# EasyEDA Pro project ProDocument_FAB-O-MATIC_2024-05-17.epro

# Schematic FAB-O-MATIC

## Sheets
1 Schematics
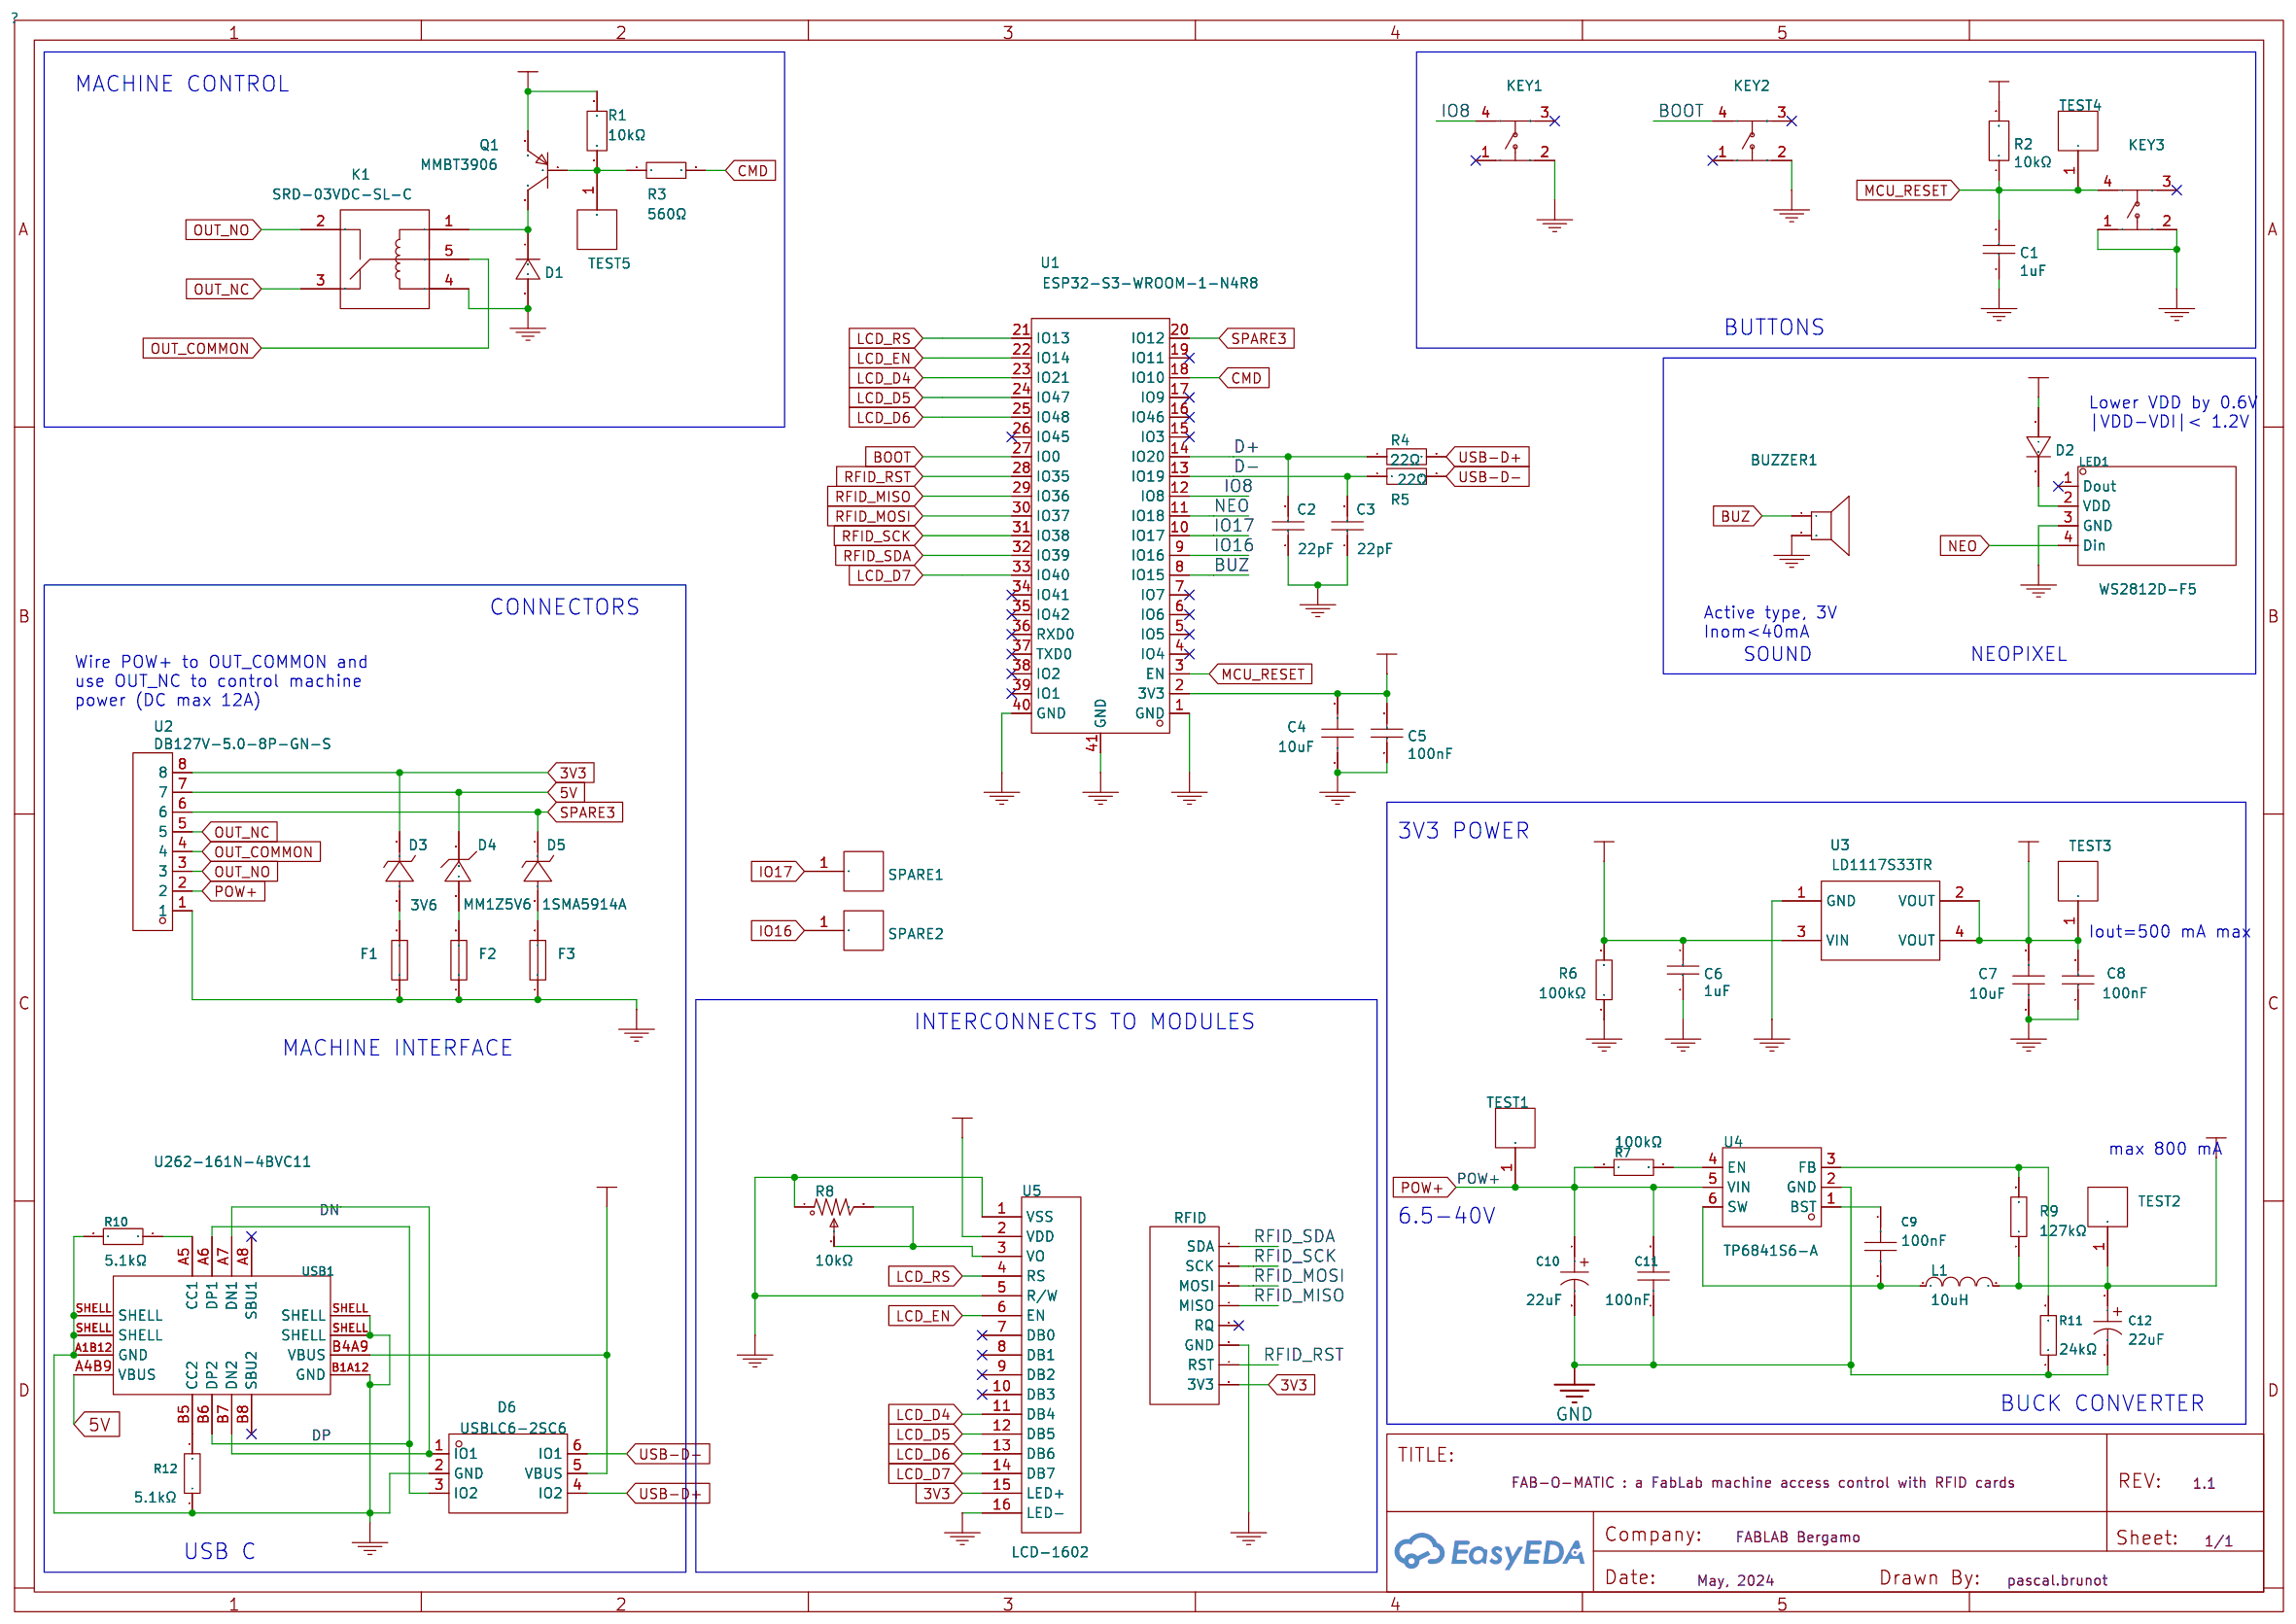
[diagram p0: Schematics]
2 Notes: Create Date: 2024-05-12; Page Name: Notes; Project Name: FAB-O-MATIC : a FabLab machine access control with RFID cards; Schematic Name: FAB-O-MATIC; Update Date: 2024-05-17; Company: EasyEDA.com; Drawn: EasyEDA; Page Size: A4; Part Number: JLCPCB-002; Reviewed: EasyEDA; Version: V0.1
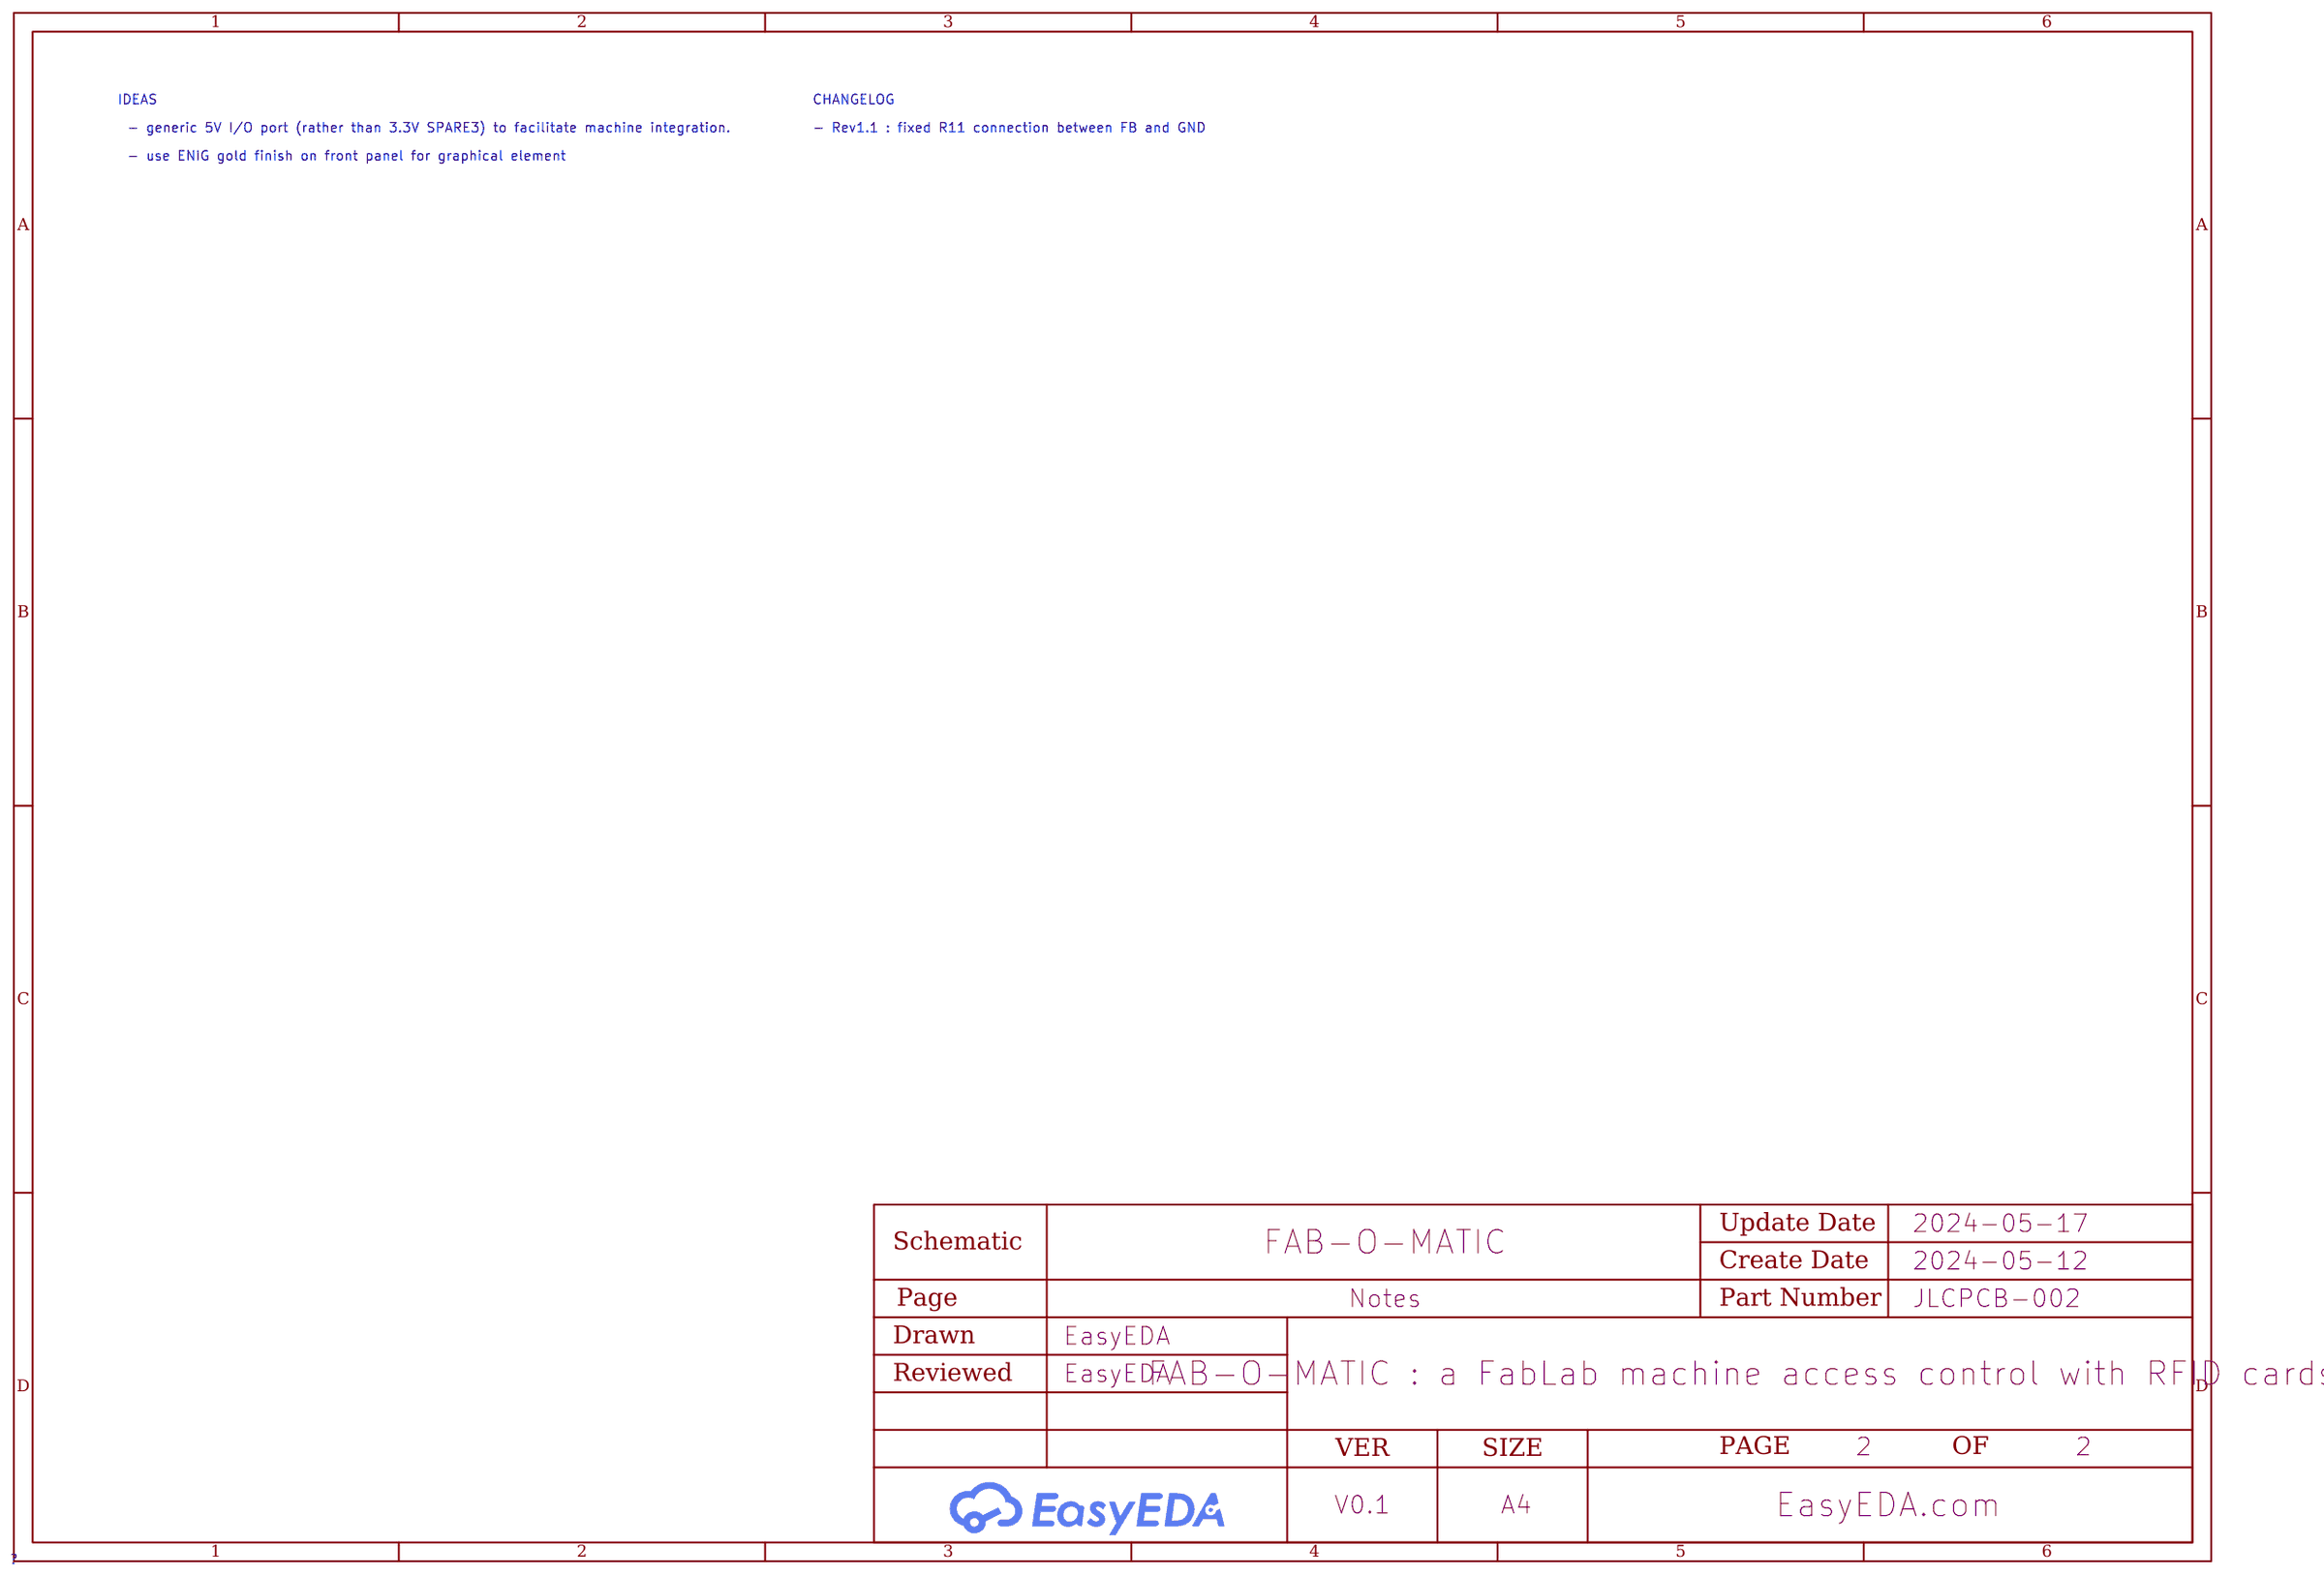
[diagram p1: Notes]

## Parts
BUZZER1  4kHz  [BUZ-TH_BD12.5-P6.50-D0.9]
C1  1uF  [C0805]
C2  22pF  [C0603]
C3  22pF  [C0603]
C4  10uF  [C0805]
C5  100nF  [C0805]
C6  1uF  [C0805]
C7  10uF  [C0805]
C8  100nF  [C0805]
C9  100nF  [C0603]
C10  22uF  [CAP-SMD_BD6.3-L6.6-W6.6-FD]
C11  100nF  [C0603]
C12  22uF  [CAP-SMD_BD6.3-L6.6-W6.6-FD]
D1  SM4007PL  [SOD-123F_L2.8-W1.8-LS3.7-RD]
D2  SM4007PL  [SOD-123F_L2.8-W1.8-LS3.7-RD]
D3  3V6  [SMA_L4.4-W2.6-LS5.1-RD]
D4  MM1Z5V6  [SOD-123_L2.8-W1.8-LS3.7-RD]
D5  1SMA5914A  [SMA_L4.4-W2.6-LS5.1-RD]
D6  USBLC6-2SC6  [SOT-23-6_L2.9-W1.6-P0.95-LS2.8-BL]
F1  1206L016WR  [F1206]
F2  1206L016WR  [F1206]
F3  1206L016WR  [F1206]
K1  SRD-03VDC-SL-C  [RELAY-TH_SRD-03VDC-SL-C]
KEY1  TSA063G60-250  [KEY-SMD_4P-L6.1-W6.1-P4.50-LS9.0]
KEY2  TSA063G60-250  [KEY-SMD_4P-L6.1-W6.1-P4.50-LS9.0]
KEY3  TSA063G60-250  [KEY-SMD_4P-L6.1-W6.1-P4.50-LS9.0]
L1  10uH  [IND-SMD_L4.0-W4.0]
LED1  WS2812D-F5  [LED-TH_4P-BD5.8-P1.30]
P1  RFID  [footprint_17af]
Q1  MMBT3906  [SOT-23-3_L2.9-W1.3-P1.90-LS2.4-BR]
R1  10kΩ  [R0805]
R2  10kΩ  [R0805]
R3  560Ω  [R0805]
R4  22Ω  [R0603]
R5  22Ω  [R0603]
R6  100kΩ  [R0805]
R7  100kΩ  [R0603]
R8  10kΩ  [RES-ADJ-TH_3362P]
R9  127kΩ  [R0603]
R10  5.1kΩ  [R0603]
R11  24kΩ  [R0603]
R12  5.1kΩ  [R0603]
SPARE1  0577-0-43-80-21-27-10-0  [footprint_662d]  (no BOM)
SPARE2  0577-0-43-80-21-27-10-0  [footprint_662d]  (no BOM)
TEST1  0577-0-43-80-21-27-10-0  [footprint_662d]  (no BOM)
TEST2  0577-0-43-80-21-27-10-0  [footprint_662d]  (no BOM)
TEST3  0577-0-43-80-21-27-10-0  [footprint_662d]  (no BOM)
TEST4  0577-0-43-80-21-27-10-0  [footprint_662d]  (no BOM)
TEST5  0577-0-43-80-21-27-10-0  [footprint_662d]  (no BOM)
U1  ESP32-S3-WROOM-1-N4R8  [WIRELM-SMD_ESP32-S3-WROOM-1]
U2  DB127V-5.0-8P-GN-S  [CONN-TH_8P-P5.00_DB127V-5.0-8P-GN-S]
U3  LD1117S33TR  [SOT-223_L6.5-W3.5-P2.30-LS7.0-BR]
U4  TP6841S6-A  [SOT-23-6_L2.9-W1.6-P0.95-LS2.8-BL]
U5  LCD-1602  [footprint_8a57]
USB1  U262-161N-4BVC11  [USB-3.1-SMD_U262-161N-4BVC11]

## Library data of the parts
BUZZER1 = SFN-12055PA6.5_C360607: Oscillator Circuit:无源(外部驱动) Technology Type:压电式 Frequency:4kHz Sound Pressure Level (SPL):80dB@5V,10cm Diameter (φD):12.5mm Height:6mm; LCSC Part Name: 压电无源蜂鸣器; Supplier Part: C360607; Manufacturer: S&S(海旭); Manufacturer Part: SFN-12055PA6.5; Supplier Footprint: 插件,D=12.5mm; JLCPCB Part Class: Extended Part; Datasheet: https://atta.szlcsc.com/upload/public/pdf/source/20220225/D801AF3A55A67CFB490E002F7E7725D1.pdf; Supplier: LCSC; Oscillator Circuit: 无源(外部驱动); Technology Type: 压电式; Sound Pressure Level (SPL): 80dB@5V,10cm; Diameter (φD): 12.5mm; Height: 6mm
C1 C6 = CL21B105KBFNNNE: Capacitance: Tolerance:±10% Tolerance:±10% Voltage Rated: Temperature Coefficient:; LCSC Part Name: 1uF ±10% 50V; Supplier Part: C28323; Manufacturer: SAMSUNG(三星); Supplier Footprint: 0805; JLCPCB Part Class: Basic Part; Datasheet: https://atta.szlcsc.com/upload/public/pdf/source/20160218/1457707763339.pdf; Supplier: LCSC; Tolerance: ±10%
C2 C3 = CL10C220JB8NNNC: Capacitance: Tolerance:±5% Tolerance:±5% Voltage Rated: Temperature Coefficient:; LCSC Part Name: 22pF ±5% 50V; Supplier Part: C1653; Manufacturer: SAMSUNG(三星); Supplier Footprint: 0603; JLCPCB Part Class: Basic Part; Datasheet: https://atta.szlcsc.com/upload/public/pdf/source/20160218/1457707763339.pdf; Supplier: LCSC; Tolerance: ±5%
C4 C7 = GRM21BR61H106KE43L: Capacitance: Tolerance:±10% Tolerance:±10% Voltage Rated: Temperature Coefficient:; LCSC Part Name: 10uF ±10% 50V; Supplier Part: C440198; Manufacturer: muRata(村田); Supplier Footprint: 0805; JLCPCB Part Class: Basic Part; Datasheet: https://atta.szlcsc.com/upload/public/pdf/source/20230811/95AAE0C9AF55EDC31B7A4D8B733F534E.pdf; Supplier: LCSC; Tolerance: ±10%
C5 C8 = CL21B104KCFNNNE: Capacitance: Tolerance:±10% Tolerance:±10% Voltage Rated: Temperature Coefficient:; LCSC Part Name: 100nF ±10% 100V; Supplier Part: C28233; Manufacturer: SAMSUNG(三星); Supplier Footprint: 0805; JLCPCB Part Class: Basic Part; Datasheet: https://atta.szlcsc.com/upload/public/pdf/source/20160218/1457707763339.pdf; Supplier: LCSC; Tolerance: ±10%
C9 C11 = CC0603KRX7R9BB104: Capacitance: Tolerance:±10% Tolerance:±10% Voltage Rated: Temperature Coefficient:; LCSC Part Name: 100nF ±10% 50V; Supplier Part: C14663; Manufacturer: YAGEO(国巨); Supplier Footprint: 0603; JLCPCB Part Class: Basic Part; Datasheet: https://atta.szlcsc.com/upload/public/pdf/source/20180910/C282072_33301C7F631E79921B82A8DAC6BCC5B3.pdf; Supplier: LCSC; Tolerance: ±10%
C10 C12 = RVT22UF50V67RV0028: Capacitance: Tolerance:±20% Tolerance:±20% Rated Voltage: Ripple Current:43mA@120Hz Equivalent Series Resistance(ESR):- φD: L: Lifetime @ Temp:2000hrs@105℃ Operating Temperature:-55℃~+105℃ Operating Temperature:-55℃~+105℃; LCSC Part Name: 22uF ±20% 50V; Supplier Part: C2836438; Manufacturer: KNSCHA(科尼盛); Supplier Footprint: SMD,D6.3xL5.4mm; JLCPCB Part Class: Extended Part; Datasheet: https://atta.szlcsc.com/upload/public/pdf/source/20210528/C2836438_BFA13B3627CC6B20ADD0B3BB98082A71.pdf; Supplier: LCSC; Tolerance: ±20%; Ripple Current: 43mA@120Hz; Lifetime @ Temp: 2000hrs@105℃; Operating Temperature: -55℃~+105℃
D1 D2 = SM4007PL_C64898: Diode Configuration: Forward Voltage (Vf@If):1.1V@1A Reverse Voltage (Vr): Average Rectified Current (Io): Reverse Leakage Current:10uA@1kV; LCSC Part Name: 电压:1kV 电流:1A; Supplier Part: C64898; Manufacturer: MDD; Supplier Footprint: SOD-123FL; JLCPCB Part Class: Basic Part; Datasheet: https://atta.szlcsc.com/upload/public/pdf/source/20230823/16A8FDE162764C9B685A3717F2DA3690.pdf; Supplier: LCSC; Forward Voltage (Vf@If): 1.1V@1A; Reverse Leakage Current: 10uA@1kV
D3 D5 = 1SMA5914A: Zener Voltage (Nom):3.6V Reverse Leakage Current (Ir):75uA@1V Power Dissipation:1.5W Tolerance:±5% Tolerance:±5%; Supplier Part: C713621; Manufacturer: LGE(鲁光); Supplier Footprint: DO-214AC(SMA); JLCPCB Part Class: Extended Part; Datasheet: https://atta.szlcsc.com/upload/public/pdf/source/20200826/C688904_8C7260726BAA69A6ECCD821EC44D7B0B.pdf; Supplier: LCSC; Zener Voltage (Nom): 3.6V; Reverse Leakage Current (Ir): 75uA@1V; Power Dissipation: 1.5W; Tolerance: ±5%
D4 = MM1Z5V6_C85210: Diode Configuration:Single Zener Voltage (Nom):5.6V Reverse Leakage Current (Ir):1uA@2.5V Zener Voltage (Range):5.2V~6V Zener Voltage (Range):5.2V~6V Power Dissipation:500mW Zener Impedance (Zzt):80Ω Tolerance:±5% Tolerance:±5%; Supplier Part: C85210; Manufacturer: ST(先科); Supplier Footprint: SOD-123; JLCPCB Part Class: Extended Part; Datasheet: https://atta.szlcsc.com/upload/public/pdf/source/20170914/C118610_1505373983764968880.pdf; Supplier: LCSC; Diode Configuration: Single; Zener Voltage (Nom): 5.6V; Reverse Leakage Current (Ir): 1uA@2.5V; Zener Voltage (Range): 5.2V~6V; Power Dissipation: 500mW; Zener Impedance (Zzt): 80Ω; Tolerance: ±5%
D6 = USBLC6-2SC6_C2827654: polarity:- Reverse Stand-Off Voltage (Vrwm):- Maximum Clamping Voltage:- Peak Pulse Current (Ipp)@10/1000us:- Peak Pulse Power Dissipation (Ppp)@10/1000us:- Breakdown Voltage:- Reverse Leakage Current (Ir):- Operating Temperature:- Operating Temperature:-; LCSC Part Name: ESD，可防30kV静电; Supplier Part: C2827654; Manufacturer: TECH PUBLIC(台舟); Supplier Footprint: SOT-23-6; JLCPCB Part Class: Extended Part; Datasheet: https://atta.szlcsc.com/upload/public/pdf/source/20210810/FBD75DE717D6D97BAC6DD7F2B5C09DCD.pdf; Supplier: LCSC; Type: ESD
F1-F3 = 1206L016WR: Operating Voltage (Max):30V Current Rating (Max):100A Hold Current:160mA Trip Current:370mA Power Dissipation:- Resistance - Initial (Ri) (Min):1.2Ω Resistance - Post Trip (R1) (Max):4.5Ω Maximum Time to Trip:300ms Operating Temperature:-40℃~+85℃ Operatin; LCSC Part Name: 30V 160mA 1206自恢复; Supplier Part: C151161; Manufacturer: Littelfuse(美国力特); Supplier Footprint: 1206; JLCPCB Part Class: Extended Part; Datasheet: https://atta.szlcsc.com/upload/public/pdf/source/20181031/C315893_583812352E070A3E75892B744443DEDE.pdf; Supplier: LCSC; Operating Voltage (Max): 30V; Current Rating (Max): 100A; Hold Current: 160mA; Trip Current: 370mA; Resistance - Initial (Ri) (Min): 1.2Ω; Resistance - Post Trip (R1) (Max): 4.5Ω; Maximum Time to Trip: 300ms; Operating Temperature: -40℃~+85℃
K1 = SRD-03VDC-SL-C: Coil Voltage:3V Contact Form:一组转换:1C(SPDT-转换) Pin Number:5 Contact Rating:- Maximum Switching Voltage:250V@AC Coil Rated Power:360mW Maximum Switching Current:15A Coil Type:无极性-单线圈 Contact Resistance:100mΩ Operate Time:10ms Release Time:10ms; LCSC Part Name: 3V继电器 单刀双掷 蓝色; Supplier Part: C496430; Manufacturer: 松乐; Supplier Footprint: 插件,15.6x19.2mm; JLCPCB Part Class: Extended Part; Datasheet: https://atta.szlcsc.com/upload/public/pdf/source/20211029/0AF1F09028F3938DCCE87F54F358E4BA.pdf; Supplier: LCSC; Coil Voltage: 3V; Contact Form: 一组转换:1C(SPDT-转换); Pin Number: 5; Maximum Switching Voltage: 250V@AC; Coil Rated Power: 360mW; Maximum Switching Current: 15A; Coil Type: 无极性-单线圈; Contact Resistance: 100mΩ; Operate Time: 10ms; Release Time: 10ms
KEY1-KEY3 = TSA063G60-250: Circuit:SPST Actuator Style:Round Button Operating Force:250gf Mounting Style:Brick nogging Switch Length:6.1mm Switch Width:6.1mm Switch Height:6mm Strike Gundam:不带 Contact Current:50mA Voltage Rating (DC):12V Insulation Resistance:100MΩ Actuator/Cap Col; LCSC Part Name: 6.1*6.1*6mm 立贴 轻触开关; Supplier Part: C294566; Manufacturer: BRIGHT(博瑞泰); Supplier Footprint: SMD; JLCPCB Part Class: Extended Part; Datasheet: https://atta.szlcsc.com/upload/public/pdf/source/20181029/C294570_15EFF1F4D215547575AD6307D8A439BB.pdf; Supplier: LCSC; Circuit: SPST; Actuator Style: Round Button; Operating Force: 250gf; Mounting Style: Brick nogging; Switch Length: 6.1mm; Switch Width: 6.1mm; Switch Height: 6mm; Strike Gundam: 不带; Contact Current: 50mA; Voltage Rating (DC): 12V; Insulation Resistance: 100MΩ; Actuator/Cap Color: Black; With Lamp: No; Pin Style: Gull Wing; Mechanical Life: 5万次; Operating Temperature: -25℃~+70℃
L1 = SWPA4030S100MT: Inductance: Tolerance:±20% Tolerance:±20% Rated Current: Saturation Current (Isat):2.4A DC Resistance (DCR): Type:- Ratings:-; LCSC Part Name: 10uH ±20% 2.4A; Supplier Part: C38117; Manufacturer: Sunlord(顺络); Supplier Footprint: SMD; JLCPCB Part Class: Extended Part; Datasheet: https://atta.szlcsc.com/upload/public/pdf/source/20231024/317626D2AA2F8AB4113C1875E432E6E1.pdf; Supplier: LCSC; Tolerance: ±20%; Saturation Current (Isat): 2.4A
LED1 = WS2812D-F5: Lamp Holder Type:5mm圆形灯头; Supplier Part: C190565; Manufacturer: worldsemi; Supplier Footprint: 插件,D=5mm; JLCPCB Part Class: Extended Part; Datasheet: https://atta.szlcsc.com/upload/public/pdf/source/20220418/4832EF9FB0C1B68C1F4176435955B165.pdf; Supplier: LCSC; Lamp Holder Type: 5mm圆形灯头
P1 = RFID: Supplier Part: C27438; Supplier: LCSC; Manufacturer: BOOMELE; Manufacturer Part: Female headerHDR1X8-2.54
Q1 = MMBT3906_C466523: Transistor Type: Collector Current (Ic): Collector-Emitter Breakdown Voltage (Vceo): Power Dissipation (Pd): Transition Frequency (fT):300MHz Collector Cut-Off Current (Icbo):100nA Collector-Emitter Saturation Voltage (VCE(sat)@Ic,Ib):300mV@50mA,5mA Opera; LCSC Part Name: PNP 电流:200mA 耐压:40V; Supplier Part: C466523; Manufacturer: High Diode(海德); Supplier Footprint: SOT-23; JLCPCB Part Class: Extended Part; Datasheet: https://atta.szlcsc.com/upload/public/pdf/source/20191203/C466523_970B32749544E07B58B65C8C9237BEC1.pdf; Supplier: LCSC; Transition Frequency (fT): 300MHz; Collector Cut-Off Current (Icbo): 100nA; Collector-Emitter Saturation Voltage (VCE(sat)@Ic,Ib): 300mV@50mA,5mA
R1 R2 = 0805W8F1002T5E: Type:Thick Film Resistors Resistance:10kΩ Tolerance:±1% Tolerance:±1% Power(Watts): Overload Voltage (Max): Temperature Coefficient:±100ppm/℃ Temperature Coefficient:±100ppm/℃ Operating Temperature Range:-55℃~+155℃ Operating Temperature Range:-55℃~+155℃; LCSC Part Name: 10kΩ ±1% 125mW 厚膜电阻; Supplier Part: C17414; Manufacturer: UNI-ROYAL(厚声); Supplier Footprint: 0805; JLCPCB Part Class: Basic Part; Datasheet: https://atta.szlcsc.com/upload/public/pdf/source/20200306/C422600_1E6D84923E4A46A82E41ADD87F860B5C.pdf; Supplier: LCSC; Type: Thick Film Resistors; Tolerance: ±1%; Temperature Coefficient: ±100ppm/℃; Operating Temperature Range: -55℃~+155℃
R3 = 0805W8F5600T5E: Type:Thick Film Resistors Resistance: Tolerance:±1% Tolerance:±1% Power(Watts): Overload Voltage (Max): Temperature Coefficient:±100ppm/℃ Temperature Coefficient:±100ppm/℃ Operating Temperature Range:-55℃~+155℃ Operating Temperature Range:-55℃~+155℃; LCSC Part Name: 560Ω ±1% 125mW 厚膜电阻; Supplier Part: C28636; Manufacturer: UNI-ROYAL(厚声); Supplier Footprint: 0805; JLCPCB Part Class: Basic Part; Datasheet: https://atta.szlcsc.com/upload/public/pdf/source/20200306/C422600_1E6D84923E4A46A82E41ADD87F860B5C.pdf; Supplier: LCSC; Type: Thick Film Resistors; Tolerance: ±1%; Temperature Coefficient: ±100ppm/℃; Operating Temperature Range: -55℃~+155℃
R4 R5 = 0603WAF220JT5E: Type:Thick Film Resistors Resistance:22Ω Tolerance:±1% Tolerance:±1% Power(Watts): Overload Voltage (Max): Temperature Coefficient:±100ppm/℃ Temperature Coefficient:±100ppm/℃ Operating Temperature Range:-55℃~+155℃ Operating Temperature Range:-55℃~+155℃; LCSC Part Name: 22Ω ±1% 100mW 厚膜电阻; Supplier Part: C23345; Manufacturer: UNI-ROYAL(厚声); Supplier Footprint: 0603; JLCPCB Part Class: Basic Part; Datasheet: https://atta.szlcsc.com/upload/public/pdf/source/20200306/C422600_1E6D84923E4A46A82E41ADD87F860B5C.pdf; Supplier: LCSC; Type: Thick Film Resistors; Tolerance: ±1%; Temperature Coefficient: ±100ppm/℃; Operating Temperature Range: -55℃~+155℃; Resistance: 22
R6 = 0805W8F1003T5E: Type:Thick Film Resistors Resistance:100kΩ Tolerance:±1% Tolerance:±1% Power(Watts): Overload Voltage (Max): Temperature Coefficient:±100ppm/℃ Temperature Coefficient:±100ppm/℃ Operating Temperature Range:-55℃~+155℃ Operating Temperature Range:-55℃~+155℃; LCSC Part Name: 100kΩ ±1% 125mW 厚膜电阻; Supplier Part: C149504; Manufacturer: UNI-ROYAL(厚声); Supplier Footprint: 0805; JLCPCB Part Class: Basic Part; Datasheet: https://atta.szlcsc.com/upload/public/pdf/source/20200306/C422600_1E6D84923E4A46A82E41ADD87F860B5C.pdf; Supplier: LCSC; Type: Thick Film Resistors; Tolerance: ±1%; Temperature Coefficient: ±100ppm/℃; Operating Temperature Range: -55℃~+155℃
R7 = 0603WAF1003T5E: Type:Thick Film Resistors Resistance:100kΩ Tolerance:±1% Tolerance:±1% Power(Watts): Overload Voltage (Max): Temperature Coefficient:±100ppm/℃ Temperature Coefficient:±100ppm/℃ Operating Temperature Range:-55℃~+155℃ Operating Temperature Range:-55℃~+155℃; LCSC Part Name: 100kΩ ±1% 100mW 厚膜电阻; Supplier Part: C25803; Manufacturer: UNI-ROYAL(厚声); Supplier Footprint: 0603; JLCPCB Part Class: Basic Part; Datasheet: https://atta.szlcsc.com/upload/public/pdf/source/20200306/C422600_1E6D84923E4A46A82E41ADD87F860B5C.pdf; Supplier: LCSC; Type: Thick Film Resistors; Tolerance: ±1%; Temperature Coefficient: ±100ppm/℃; Operating Temperature Range: -55℃~+155℃
R8 = 3362P-1-103_C118956: Resistance: Tolerance:±10% Tolerance:±10%; LCSC Part Name: 10kΩ ±10%; Supplier Part: C118956; Manufacturer: BOCHEN(博晨); Manufacturer Part: 3362P-1-103; Supplier Footprint: 插件; JLCPCB Part Class: Extended Part; Datasheet: https://atta.szlcsc.com/upload/public/pdf/source/20171114/C118956_15106326650691117445.pdf; Supplier: LCSC; Tolerance: ±10%
R9 = RC0603FR-07127KL: Type:Thick Film Resistors Resistance: Tolerance:±1% Tolerance:±1% Power(Watts): Overload Voltage (Max): Temperature Coefficient:±100ppm/℃ Temperature Coefficient:±100ppm/℃ Operating Temperature Range:-55℃~+155℃ Operating Temperature Range:-55℃~+155℃; LCSC Part Name: 厚膜电阻 127kΩ ±1% 100mW; Supplier Part: C245905; Manufacturer: YAGEO(国巨); Supplier Footprint: 0603; JLCPCB Part Class: Extended Part; Datasheet: https://atta.szlcsc.com/upload/public/pdf/source/20181031/C326976_E9901E35333D136A19B6CE377E889A82.pdf; Supplier: LCSC; Type: Thick Film Resistors; Tolerance: ±1%; Temperature Coefficient: ±100ppm/℃; Operating Temperature Range: -55℃~+155℃
R10 R12 = 0603WAF5101T5E: Type:Thick Film Resistors Resistance:5.1kΩ Tolerance:±1% Tolerance:±1% Power(Watts): Overload Voltage (Max): Temperature Coefficient:±100ppm/℃ Temperature Coefficient:±100ppm/℃ Operating Temperature Range:-55℃~+155℃ Operating Temperature Range:-55℃~+155℃; LCSC Part Name: 5.1kΩ ±1% 100mW 厚膜电阻; Supplier Part: C23186; Manufacturer: UNI-ROYAL(厚声); Supplier Footprint: 0603; JLCPCB Part Class: Basic Part; Datasheet: https://atta.szlcsc.com/upload/public/pdf/source/20200306/C422600_1E6D84923E4A46A82E41ADD87F860B5C.pdf; Supplier: LCSC; Type: Thick Film Resistors; Tolerance: ±1%; Temperature Coefficient: ±100ppm/℃; Operating Temperature Range: -55℃~+155℃
R11 = 0603WAF2402T5E: Type:Thick Film Resistors Resistance:24kΩ Tolerance:±1% Tolerance:±1% Power(Watts): Overload Voltage (Max): Temperature Coefficient:±100ppm/℃ Temperature Coefficient:±100ppm/℃ Operating Temperature Range:-55℃~+155℃ Operating Temperature Range:-55℃~+155℃; LCSC Part Name: 24kΩ ±1% 100mW 厚膜电阻; Supplier Part: C23352; Manufacturer: UNI-ROYAL(厚声); Supplier Footprint: 0603; JLCPCB Part Class: Basic Part; Datasheet: https://atta.szlcsc.com/upload/public/pdf/source/20200306/C422600_1E6D84923E4A46A82E41ADD87F860B5C.pdf; Supplier: LCSC; Type: Thick Film Resistors; Tolerance: ±1%; Temperature Coefficient: ±100ppm/℃; Operating Temperature Range: -55℃~+155℃
SPARE1 SPARE2 TEST1-TEST5 = 0577-0-43-80-21-27-10-0: Supplier: LCSC; Supplier Part: C2895400; Manufacturer: null; JLCPCB Part Class: Extended Part
U1 = ESP32-S3-WROOM-1-N4R8: LCSC Part Name: 通用型Wi-Fi+低功耗蓝牙MCU模组; Supplier Part: C2913200; Manufacturer: ESPRESSIF(乐鑫); Supplier Footprint: SMD,18x25.5mm; JLCPCB Part Class: Extended Part; Datasheet: https://atta.szlcsc.com/upload/public/pdf/source/20220628/A2AC12B3C87735CAEB7EBE2DBE80936C.pdf; Supplier: LCSC; spicePre: U
U2 = DB127V-5.0-8P-GN-S: Structure:1x8P Pitch:5mm Color:Green Mounting Style:Straight Current Rating (Max):15A Voltage Rating (Max):250V Number of Pins:8P Number of Rows:1 Wire Gauge - AWG:14~26 Wire Gauge - AWG:14~26 Wire Gauge - mm2:1.5 Wire Gauge - mm2:1.5 Number of PINs Per R; LCSC Part Name: 5mm 1x8P 排数:1 每排P数:8 直插; Supplier Part: C430626; Manufacturer: DORABO(地博电气); Supplier Footprint: 插件,P=5mm; JLCPCB Part Class: Extended Part; Datasheet: https://atta.szlcsc.com/upload/public/pdf/source/20230106/9CDB472D403F670588C42D375AEF1B30.pdf; Supplier: LCSC; Structure: 1x8P; Pitch: 5mm; Color: Green; Mounting Style: Straight; Current Rating (Max): 15A; Voltage Rating (Max): 250V; Number of Pins: 8P; Number of Rows: 1; Wire Gauge - AWG: 14~26; Wire Gauge - mm2: 1.5; Number of PINs Per Row: 8; Operating Temperature Range: -40℃~+105℃
U3 = LD1117S33TR: Output Type: Maximum Input Voltage:15V Output Voltage:3.3V Output Voltage:3.3V MAX Output Current:800mA Power Supply Rejection Ratio (PSRR):75dB@(120Hz) Dropout Voltage:1.2V@(800mA) standby current:10mA Operating Temperature:0℃~+125℃ Operating Temperature; LCSC Part Name: 输入15V 输出3.3V 800mA; Supplier Part: C86781; Manufacturer: ST(意法半导体); Supplier Footprint: SOT-223; JLCPCB Part Class: Extended Part; Datasheet: https://atta.szlcsc.com/upload/public/pdf/source/20181022/C283467_00098992BB1D287195B66486CE33A2DD.pdf; Supplier: LCSC; Maximum Input Voltage: 15V; Output Voltage: 3.3V; MAX Output Current: 800mA; Power Supply Rejection Ratio (PSRR): 75dB@(120Hz); Dropout Voltage: 1.2V@(800mA); standby current: 10mA; Operating Temperature: 0℃~+125℃; Output Polarity: Positive electrode; Number of Outputs: 1
U4 = TP6841S6-A: Supplier Part: C2844924; Manufacturer: TECH PUBLIC(台舟); Supplier Footprint: SOT-23-6; JLCPCB Part Class: Extended Part; Datasheet: https://atta.szlcsc.com/upload/public/pdf/source/20210709/C2844924_E200F0B809810750A1B5AEDD4B4FD840.pdf; Supplier: LCSC
U5 = LCD-1602: Manufacturer Part: ?
USB1 = U262-161N-4BVC11: Connector Type:Type-C Standard:USB 3.1 Gender:Female Number of Ports:1 Number of Contacts:16P Mounting Style:卧贴 Current Rating - Power (Max):3A Contact Material:Copper Alloy Contact Plating:Gold Operating Temperature Range:-40℃~+85℃ Operating Temperature; LCSC Part Name: Type-C 母 卧贴; Supplier Part: C319148; Manufacturer: XKB Connectivity(中国星坤); Supplier Footprint: SMD; JLCPCB Part Class: Extended Part; Datasheet: https://atta.szlcsc.com/upload/public/pdf/source/20211015/B478CBA0F1623DA36A6CC6918C49C838.pdf; Supplier: LCSC; Connector Type: Type-C; Standard: USB 3.1; Gender: Female; Number of Ports: 1; Number of Contacts: 16P; Mounting Style: 卧贴; Current Rating - Power (Max): 3A; Contact Material: Copper Alloy; Contact Plating: Gold; Operating Temperature Range: -40℃~+85℃; Soldering Temperature(Max): 260℃

## Nets
3V3: C4.2 C5.2 C7.2 C8.2 D3.1(C) P1.8(3V3) Q1.1 R1.2 R2.2 TEST3.1 U1.2(3V3) U2.8 U3.2(VOUT) U3.4(VOUT) U5.15(LED+)
5V: C6.1 C12.1 D2.2(A) D4.1(C) D6.5(VBUS) L1.2 R6.2 R9.1 TEST2.1 U2.7 U3.3(VIN) U5.2(VDD) USB1.A4B9(VBUS) USB1.B4A9(VBUS)
GND: BUZZER1.2 C1.1 C2.1 C3.1 C4.1 C5.1 C6.2 C7.1 C8.1 C10.2 C11.1 C12.2 D1.2(A) D6.2(GND) F1.1 F2.1 F3.1 K1.4 KEY1.2 KEY2.2 KEY3.1 KEY3.2 LED1.3(GND) P1.6(GND) R6.1 R8.1 R10.2 R11.1 R12.1 U1.1(GND) U1.40(GND) U1.41(GND) U2.1 U3.1(GND) U4.2(GND) U5.1(VSS) U5.5(R/W) U5.16(LED-) USB1.A1B12(GND) USB1.B1A12(GND) USB1.SHELL
BOOT: KEY2.4 U1.27(IO0)
BUZ: BUZZER1.1 U1.8(IO15)
CMD: R3.2 U1.18(IO10)
D+: C2.2 R4.1 U1.14(IO20)
D-: C3.2 R5.1 U1.13(IO19)
DN: D6.1(IO1) USB1.A7(DN1) USB1.B7(DN2)
DP: D6.3(IO2) USB1.A6(DP1) USB1.B6(DP2)
IO8: KEY1.4 U1.12(IO8)
IO16: SPARE2.1 U1.9(IO16)
IO17: SPARE1.1 U1.10(IO17)
LCD_D4: U1.23(IO21) U5.11(DB4)
LCD_D5: U1.24(IO47) U5.12(DB5)
LCD_D6: U1.25(IO48) U5.13(DB6)
LCD_D7: U1.33(IO40) U5.14(DB7)
LCD_EN: U1.22(IO14) U5.6(EN)
LCD_RS: U1.21(IO13) U5.4(RS)
MCU_RESET: C1.2 KEY3.4 R2.1 TEST4.1 U1.3(EN)
NEO: LED1.4(Din) U1.11(IO18)
OUT_COMMON: K1.5 U2.4
OUT_NC: K1.3 U2.5
OUT_NO: K1.2 U2.3
POW+: C10.1 C11.2 R7.1 TEST1.1 U2.2 U4.5(VIN)
RFID_MISO: P1.4(MISO) U1.29(IO36)
RFID_MOSI: P1.3(MOSI) U1.30(IO37)
RFID_RST: P1.7(RST) U1.28(IO35)
RFID_SCK: P1.2(SCK) U1.31(IO38)
RFID_SDA: P1.1(SDA) U1.32(IO39)
SPARE3: D5.1(C) U1.20(IO12) U2.6
USB-D+: D6.4(IO2) R4.2
USB-D-: D6.6(IO1) R5.2
$1N85: D1.1(C) K1.1 Q1.3
$1N86: Q1.2 R1.1 R3.1 TEST5.1
$1N90: D2.1(C) LED1.2(VDD)
$1N92: D5.2(A) F3.2
$1N93: D3.2(A) F1.2
$1N95: D4.2(A) F2.2
$1N15737: C9.1 U4.1(BST)
$1N15956: R7.2 U4.4(EN)
$1N24952: R12.2 USB1.B5(CC2)
$1N25390: R10.1 USB1.A5(CC1)
$1N26975: R8.2 R8.3 U5.3(VO)
$1N28552: C9.2 L1.1 U4.6(SW)
Net-(R9-2): R9.2 R11.2 U4.3(FB)

Not connected (* = marked no-connect by the designer): KEY1 1* 3*; KEY2 1* 3*; KEY3 3*; LED1 1(Dout)*; P1 5(RQ)*; U1 4(IO4)* 5(IO5)* 6(IO6)* 7(IO7)* 15(IO3)* 16(IO46)* 17(IO9)* 19(IO11)* 26(IO45)* 34(IO41)* 35(IO42)* 36(RXD0)* 37(TXD0)* 38(IO2)* 39(IO1)*; U5 7(DB0)* 8(DB1)* 9(DB2)* 10(DB3)*; USB1 A8(SBU1)* B8(SBU2)*

## Notes on the sheets
sheet 1
- MACHINE CONTROL
- BUTTONS
- Lower VDD by 0.6V
  |VDD-VDI|< 1.2V
- Active type, 3V
  Inom<40mA
- CONNECTORS
- Wire POW+ to OUT_COMMON and
  use OUT_NC to control machine
  power (DC max 12A)
- SOUND
- NEOPIXEL
- 3V3 POWER
- Iout=500 mA max
- INTERCONNECTS TO MODULES
- MACHINE INTERFACE
- max 800 mA
- 6.5-40V
- BUCK CONVERTER
- USB C
sheet 2
- IDEAS
- CHANGELOG
- - generic 5V I/O port (rather than 3.3V SPARE3) to facilitate machine integration.
- - Rev1.1 : fixed R11 connection between FB and GND
- - use ENIG gold finish on front panel for graphical element

# Board PCB REV1.1
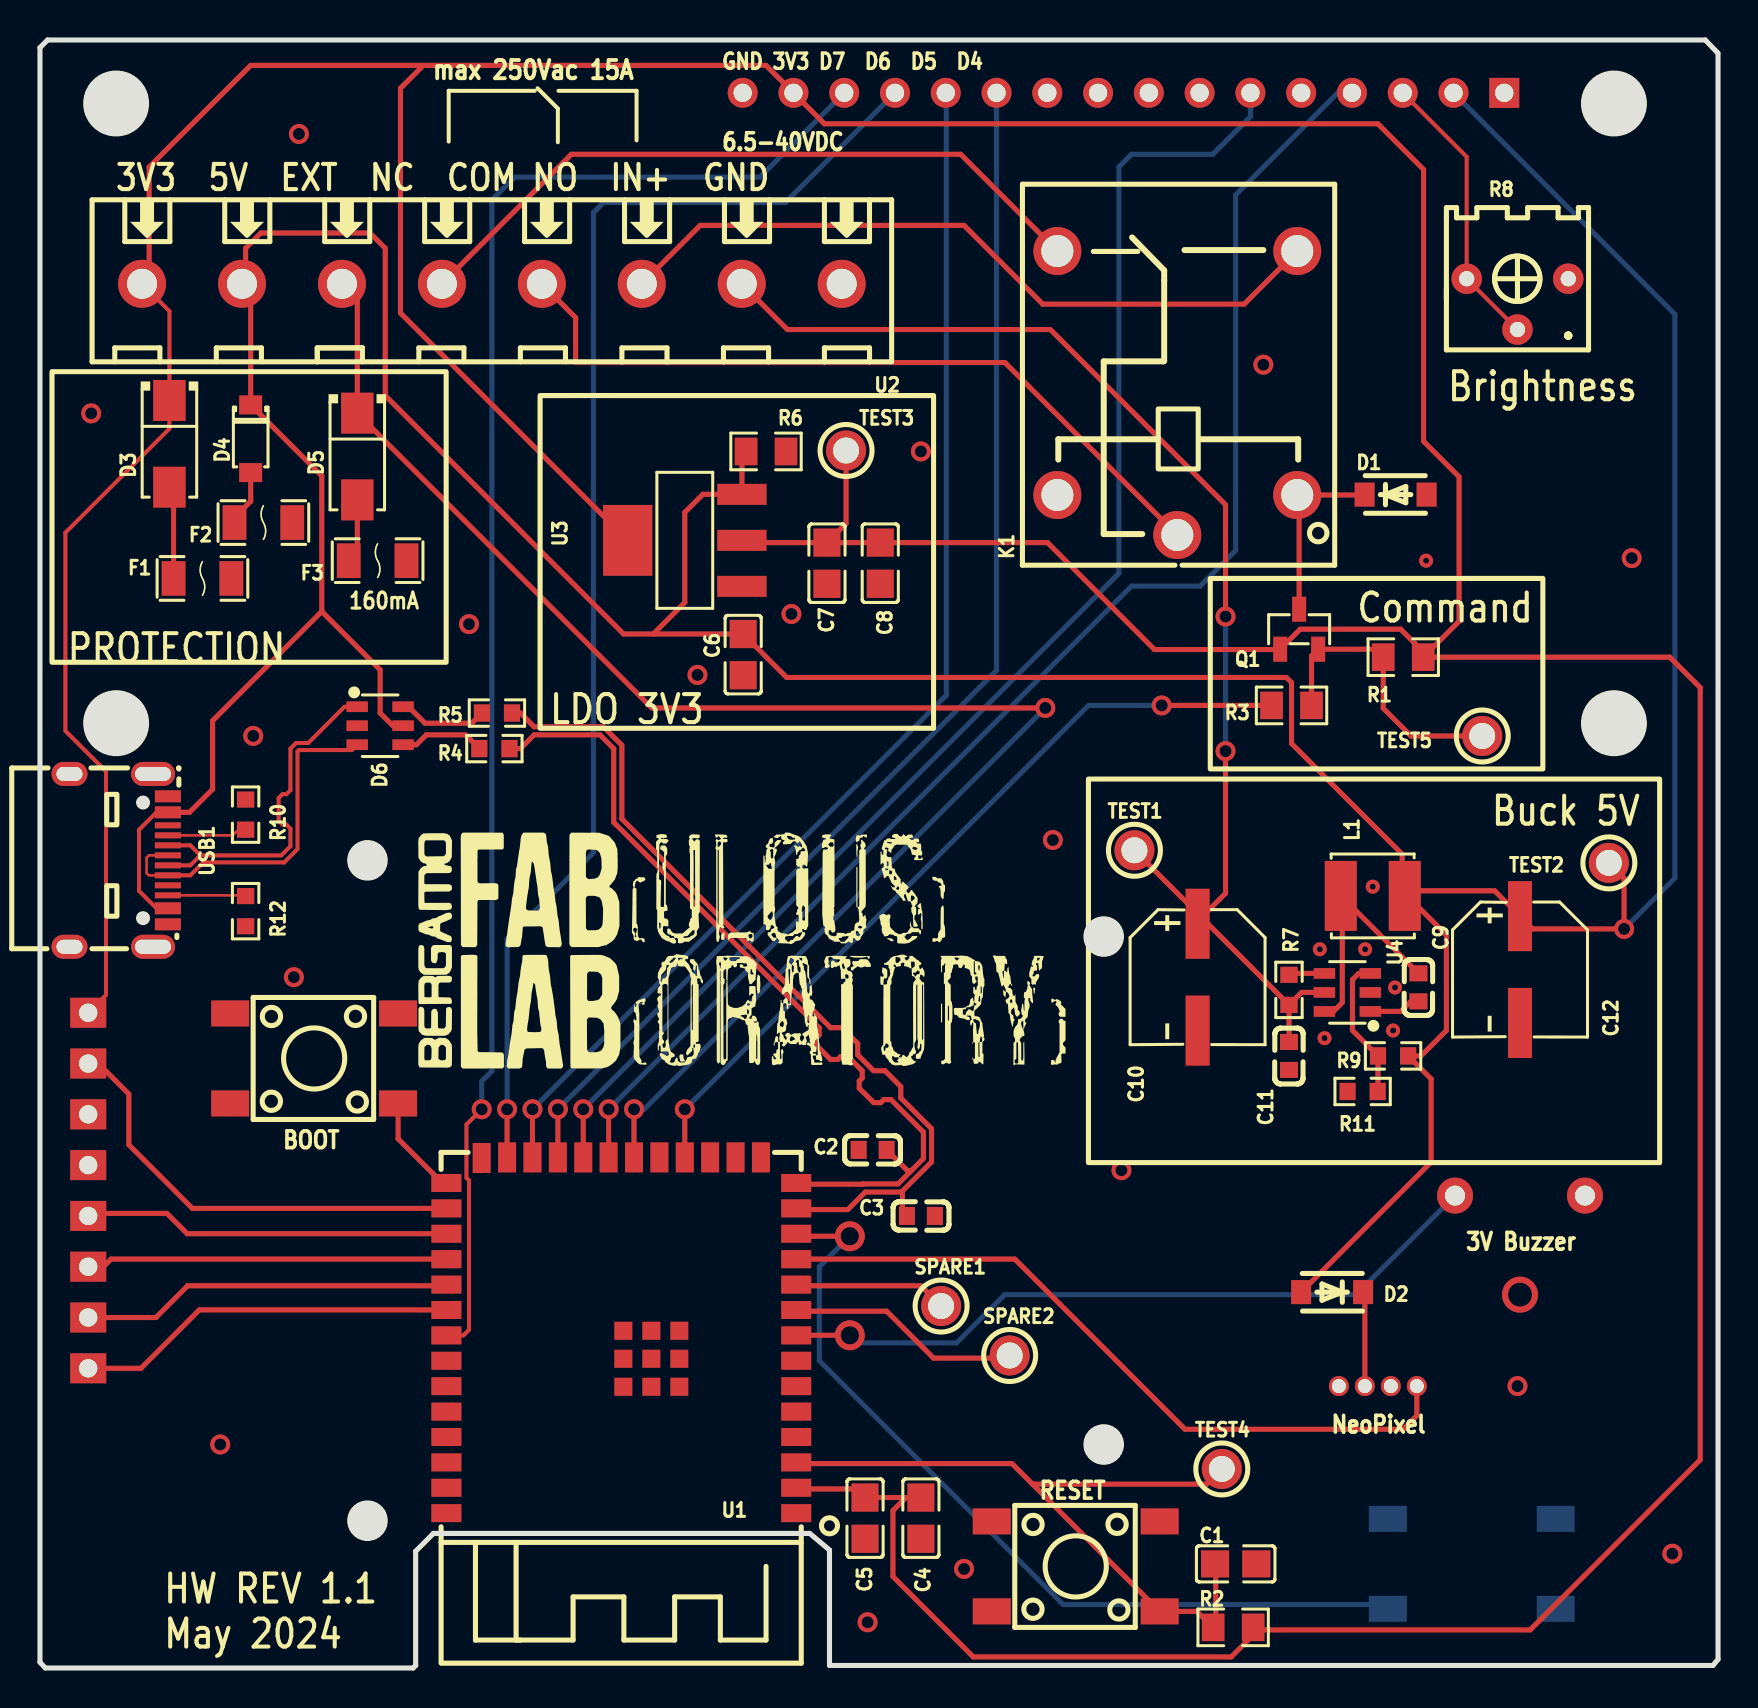
[diagram p2: board, top side]
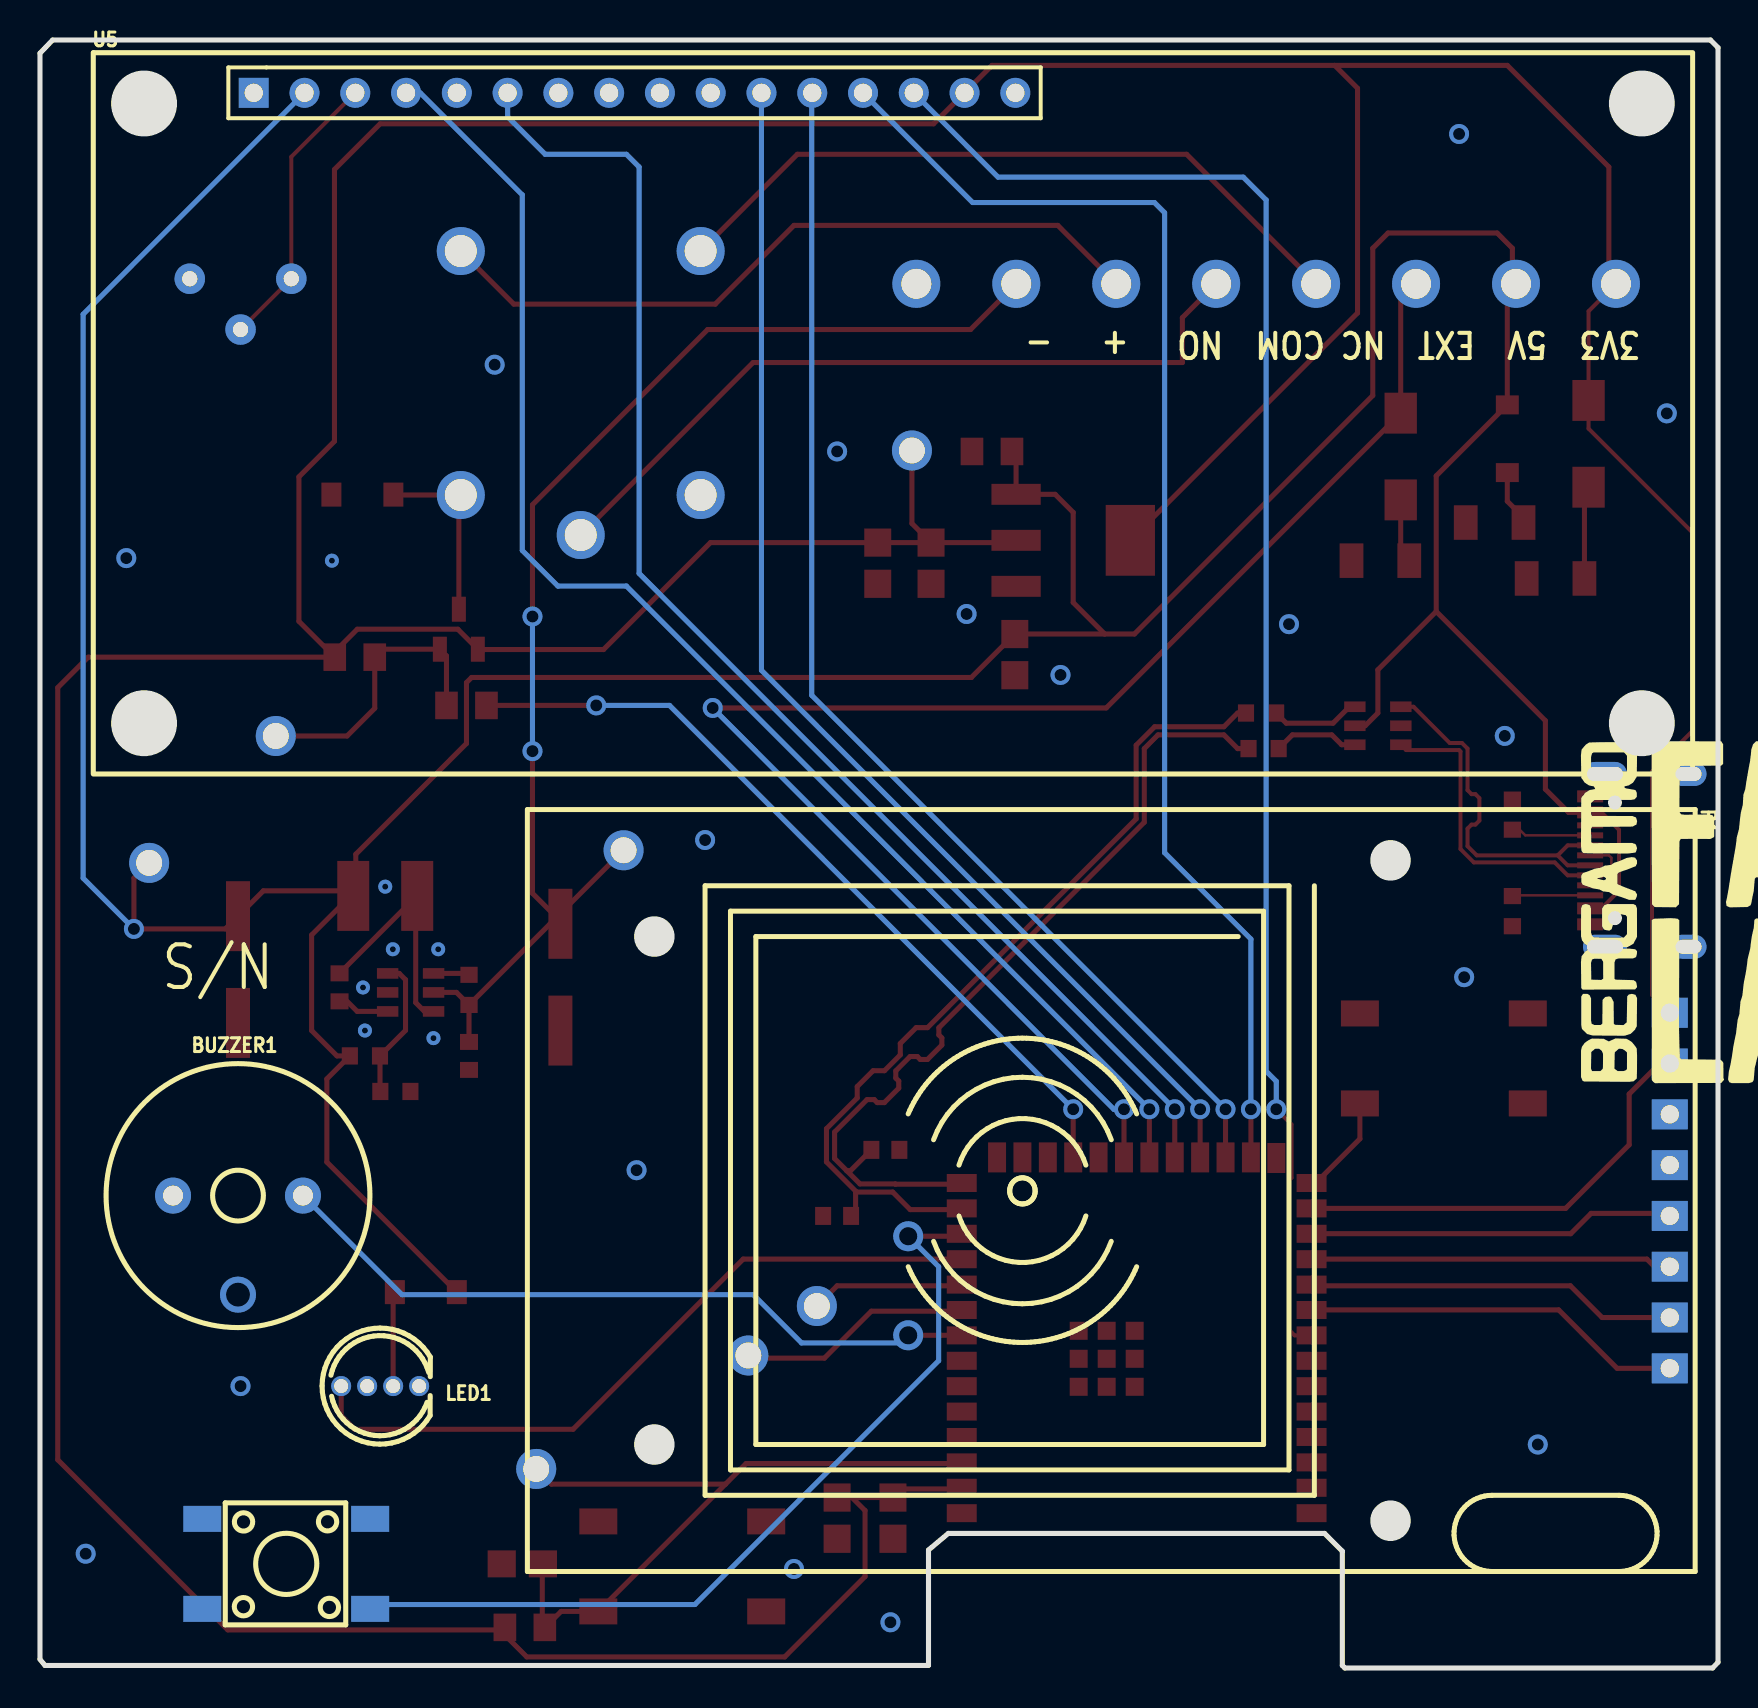
[diagram p3: board, bottom side, seen from below]

Outline 83.95 x 81.41 mm; copper layers: Top Layer, Bottom Layer. Coordinates in mm from the lower left corner of the outline.
Outline path: 0,81.03 0.38,81.41 83.31,81.41 83.95,80.75 83.95,0.43 83.7,0.13 39.62,0.13 39.5,0.13 39.5,5.9 38.51,6.73 19.69,6.73 18.8,5.84 18.8,0.13 18.67,0 0.27,0 0,0.29 0,81.03
Stack: Top Layer 0.035mm / Dielectric1 1.51mm FR4 er 4.5 / Bottom Layer 0.035mm

## Design rules (mm)
net USB-D+: DP2
net D+: DP1
net USB-D-: DP2
net D-: DP1
net DN: DP3
net DP: DP3
template: JLCPCB Capability(Two Layers Board)
spacing copperThickness1oz (default): track to track 0.102, other pairs 0.152 to 0.3
spacing copperThickness2oz: track to track 0.203, other pairs 0.152 to 0.3
track width copperThickness1oz (default): min 0.127, default 0.254, max 2.54
track width copperThickness2oz: min 0.203, default 0.254, max 2.54
differential pair differentialPair (default): width min 0.127, default 0.254, max 2.54; gap min 0.152, default 0.152
via viaSize (default): diameter min 0.5, default 0.61, max 10; hole min 0.3, default 0.305, max 6.3

## Placement (name value [footprint] x y rotation side)
BUZZER1  4kHz  [BUZ-TH_BD12.5-P6.50-D0.9]  74.04 23.62 0 bottom
C1  1uF  [C0805]  59.82 5.21 180 top
C2  22pF  [C0603]  41.66 25.91 0 top
C3  22pF  [C0603]  44.07 22.61 180 top
C4  10uF  [C0805]  44.07 7.49 90 top
C5  100nF  [C0805]  41.27 7.49 90 top
C6  1uF  [C0805]  35.18 50.67 270 top
C7  10uF  [C0805]  39.37 55.24 90 top
C8  100nF  [C0805]  42.04 55.24 90 top
C9  100nF  [C0603]  68.96 34.04 90 top
C10  22uF  [CAP-SMD_BD6.3-L6.6-W6.6-FD]  57.91 34.54 270 top
C11  100nF  [C0603]  62.48 30.61 90 top
C12  22uF  [CAP-SMD_BD6.3-L6.6-W6.6-FD]  74.04 34.92 270 top
D1  SM4007PL  [SOD-123F_L2.8-W1.8-LS3.7-RD]  67.82 58.67 0 top
D2  SM4007PL  [SOD-123F_L2.8-W1.8-LS3.7-RD]  64.64 18.8 180 top
D3  3V6  [SMA_L4.4-W2.6-LS5.1-RD]  6.48 61.21 270 top
D4  MM1Z5V6  [SOD-123_L2.8-W1.8-LS3.7-RD]  10.54 61.47 270 top
D5  1SMA5914A  [SMA_L4.4-W2.6-LS5.1-RD]  15.88 60.58 270 top
D6  USBLC6-2SC6  [SOT-23-6_L2.9-W1.6-P0.95-LS2.8-BL]  17.02 47.12 270 top
F1  1206L016WR  [F1206]  8.13 54.48 180 top
F2  1206L016WR  [F1206]  11.18 57.28 180 top
F3  1206L016WR  [F1206]  16.89 55.37 180 top
K1  SRD-03VDC-SL-C  [RELAY-TH_SRD-03VDC-SL-C]  56.9 63.75 90 top
KEY1  TSA063G60-250  [KEY-SMD_4P-L6.1-W6.1-P4.50-LS9.0]  71.63 5.21 180 bottom
KEY2  TSA063G60-250  [KEY-SMD_4P-L6.1-W6.1-P4.50-LS9.0]  13.72 30.48 0 top
KEY3  TSA063G60-250  [KEY-SMD_4P-L6.1-W6.1-P4.50-LS9.0]  51.82 5.08 0 top
L1  10uH  [IND-SMD_L4.0-W4.0]  66.67 38.61 0 top
LED1  WS2812D-F5  [LED-TH_4P-BD5.8-P1.30]  66.93 14.1 180 bottom
P1  RFID  [footprint_17af]  16.26 30.35 270 bottom
Q1  MMBT3906  [SOT-23-3_L2.9-W1.3-P1.90-LS2.4-BR]  62.99 51.94 270 top
R1  10kΩ  [R0805]  68.2 50.55 0 top
R2  10kΩ  [R0805]  59.69 2.03 0 top
R3  560Ω  [R0805]  62.61 48.13 180 top
R4  22Ω  [R0603]  22.73 45.97 180 top
R5  22Ω  [R0603]  22.86 47.75 180 top
R6  100kΩ  [R0805]  36.32 60.83 180 top
R7  100kΩ  [R0603]  62.48 33.91 90 top
R8  10kΩ  [RES-ADJ-TH_3362P]  73.91 68.2 180 top
R9  127kΩ  [R0603]  67.69 30.61 180 top
R10  5.1kΩ  [R0603]  10.29 42.67 90 top
R11  24kΩ  [R0603]  66.17 28.83 180 top
R12  5.1kΩ  [R0603]  10.29 37.85 90 top
SPARE1  0577-0-43-80-21-27-10-0  [footprint_662d]  45.08 18.1 0 top
SPARE2  0577-0-43-80-21-27-10-0  [footprint_662d]  48.51 15.63 0 top
TEST1  0577-0-43-80-21-27-10-0  [footprint_662d]  54.75 40.89 0 top
TEST2  0577-0-43-80-21-27-10-0  [footprint_662d]  78.49 40.26 0 top
TEST3  0577-0-43-80-21-27-10-0  [footprint_662d]  40.33 60.88 0 top
TEST4  0577-0-43-80-21-27-10-0  [footprint_662d]  59.12 9.95 0 top
TEST5  0577-0-43-80-21-27-10-0  [footprint_662d]  72.15 46.6 0 top
U1  ESP32-S3-WROOM-1-N4R8  [wirelm-smd_esp32-s3-wroom-1]  29.08 16.64 180 top
U2  DB127V-5.0-8P-GN-S  [CONN-TH_8P-P5.00_DB127V-5.0-8P-GN-S]  22.61 69.21 180 top
U3  LD1117S33TR  [SOT-223_L6.5-W3.5-P2.30-LS7.0-BR]  32.26 56.39 0 top
U4  TP6841S6-A  [SOT-23-6_L2.9-W1.6-P0.95-LS2.8-BL]  65.41 33.78 90 top
U5  LCD-1602  [footprint_8a57]  50.8 64.77 180 bottom
USB1  U262-161N-4BVC11  [USB-3.1-SMD_U262-161N-4BVC11]  3.94 40.39 270 top

## Footprints (pads in the part's own frame, mm; a bottom-side part is the same pattern mirrored in y, then rotated)
BUZ-TH_BD12.5-P6.50-D0.9
  round 1.8 hole 1: 1(-3.25,0) 2(3.25,0)
C0603
  rect 0.8x0.9 smd: 1(-0.7,0) 2(0.7,0)
C0805
  rect 1.41x1.35 smd: 1(-1.03,0) 2(1.03,0)
CAP-SMD_BD6.3-L6.6-W6.6-FD
  rect 3.5x1.2 smd: 1(-2.67,0) 2(2.67,0)
CONN-TH_8P-P5.00_DB127V-5.0-8P-GN-S
  round 2.4 hole 1.5: 1(-17.5,0) 2(-12.5,0) 3(-7.5,0) 4(-2.5,0) 5(2.5,0) 6(7.5,0) 7(12.5,0) 8(17.5,0)
F1206
  rect 1.19x1.728 smd: 1(-1.445,0) 2(1.445,0)
footprint_8a57
  rect 1.498x1.498 hole 0.914: 1(-22.453,13.995)
  round 1.498 hole 0.914: 2(-19.913,13.995) 3(-17.373,13.995) 4(-14.834,13.995) 5(-12.293,13.995) 6(-9.754,13.995) 7(-7.213,13.995) 8(-4.673,13.995) 9(-2.134,13.995) 10(0.406,13.995) 11(2.946,13.995) 12(5.487,13.995) 13(8.027,13.995) 14(10.566,13.995) 15(13.107,13.995) 16(15.646,13.995)
footprint_17af
  rect 1.5x1.8 hole 0.914: 1(15.367,13.844) 2(12.827,13.844) 3(10.287,13.844) 4(7.747,13.844) 5(5.207,13.844) 6(2.667,13.844) 7(0.127,13.844) 8(-2.413,13.844)
footprint_662d
  round 2 hole 1.3: 1(0,0)
IND-SMD_L4.0-W4.0
  rect 1.6x3.5 smd: 1(-1.6,0) 2(1.6,0)
KEY-SMD_4P-L6.1-W6.1-P4.50-LS9.0
  rect 1.9x1.3 smd: 1(-4.2,2.25) 2(4.2,2.25) 3(-4.2,-2.25) 4(4.2,-2.25)
LED-TH_4P-BD5.8-P1.30
  round 1 hole 0.7: 1(1.95,0) 2(0.65,0) 3(-0.65,0) 4(-1.95,0)
R0603
  rect 0.806x0.864 smd: 1(-0.753,0) 2(0.753,0)
R0805
  rect 1.133x1.377 smd: 1(-1,0) 2(1,0)
RELAY-TH_SRD-03VDC-SL-C
  round 2.4 hole 1.6: 1(-5.1,-6) 2(7.1,-6) 3(7.1,6) 4(-5.1,6) 5(-7.1,0)
RES-ADJ-TH_3362P
  round 1.524 hole 0.762: 1(-2.54,-1.27) 2(0,1.27) 3(2.54,-1.27)
SMA_L4.4-W2.6-LS5.1-RD
  rect 2.046x1.62 smd: 1(-2.169,0) 2(2.169,0)
SOD-123_L2.8-W1.8-LS3.7-RD
  rect 0.95x1.15 smd: 1(-1.692,0) 2(1.692,0)
SOD-123F_L2.8-W1.8-LS3.7-RD
  rect 1x1.2 smd: 1(-1.55,0) 2(1.55,0)
SOT-23-3_L2.9-W1.3-P1.90-LS2.4-BR
  rect 1.25x0.7 smd: 1(1,-0.95) 2(1,0.95) 3(-1,0)
SOT-23-6_L2.9-W1.6-P0.95-LS2.8-BL
  rect 0.532x1.072 smd: 1(-0.95,-1.149) 2(0,-1.149) 3(0.95,-1.149) 4(0.95,1.149) 5(0,1.149) 6(-0.95,1.149)
SOT-223_L6.5-W3.5-P2.30-LS7.0-BR
  rect 2.465x1.05 smd: 1(2.857,-2.3) 2(2.857,0) 3(2.857,2.3)
  rect 2.465x3.54 smd: 4(-2.857,0)
USB-3.1-SMD_U262-161N-4BVC11
  rect 0.6x1.3 smd: A1B12(-3.2,2.462) A4B9(-2.4,2.462) B1A12(3.2,2.462) B4A9(2.4,2.462)
  rect 0.3x1.3 smd: A5(-1.25,2.462) A6(-0.25,2.462) A7(0.25,2.462) A8(1.25,2.462) B5(1.75,2.462) B6(0.75,2.462) B7(-0.75,2.462) B8(-1.75,2.462)
  oval 1.2x2.2 hole 0.7x1.8: SHELL(-4.32,1.719) SHELL(4.32,1.719)
  oval 1.2x1.8 hole 0.7x1.3: SHELL(-4.32,-2.462) SHELL(4.32,-2.462)
wirelm-smd_esp32-s3-wroom-1
  rect 1.5x0.9 smd: 1(-8.75,8.895) 2(-8.75,7.625) 3(-8.75,6.355) 4(-8.75,5.085) 5(-8.75,3.815) 6(-8.75,2.545) 7(-8.75,1.275) 8(-8.75,0.005) 9(-8.75,-1.265) 10(-8.75,-2.535) 11(-8.75,-3.805) 12(-8.75,-5.075) 13(-8.75,-6.345) 14(-8.75,-7.615) 27(8.75,-7.615) 28(8.75,-6.345) 29(8.75,-5.075) 30(8.75,-3.805) 31(8.75,-2.535) 32(8.75,-1.265) 33(8.75,0.005) 34(8.75,1.275) 35(8.75,2.545) 36(8.75,3.815) 37(8.75,5.085) 38(8.75,6.355) 39(8.75,7.625) 40(8.75,8.895)
  rect 0.9x1.5 smd: 15(-6.985,-8.895) 16(-5.715,-8.895) 17(-4.445,-8.895) 18(-3.175,-8.895) 19(-1.905,-8.895) 20(-0.635,-8.895) 21(0.635,-8.895) 22(1.905,-8.895) 23(3.175,-8.895) 24(4.445,-8.895) 25(5.715,-8.895) 26(6.985,-8.865)
  rect 0.9x0.9 smd: 41(-2.9,2.575) 41(-2.9,1.175) 41(-2.9,-0.225) 41(-1.5,2.575) 41(-1.5,1.175) 41(-1.5,-0.225) 41(-0.1,2.575) 41(-0.1,1.175) 41(-0.1,-0.225)

## Nets
As in the schematic, except:
GND: BUZZER1.2 C1.1 C2.1 C3.1 C4.1 C5.1 C6.2 C7.1 C8.1 C10.2 C11.1 C12.2 D1.2 D6.2 F1.1 F2.1 F3.1 K1.4 KEY1.2 KEY2.2 KEY3.1 KEY3.2 LED1.3 P1.6 R6.1 R8.1 R10.2 R11.2 R12.1 U1.1 U1.40 U1.41 U2.1 U3.1 U4.2 U5.1 U5.5 U5.16 USB1.A1B12 USB1.B1A12 USB1.SHELL
$1N15594: R9.2 R11.1 U4.3

Pads without a net: KEY1 1 3; KEY2 1 3; KEY3 3; LED1 1; P1 5; U1 4 5 6 7 15 16 17 19 26 34 35 36 37 38 39; U5 7 8 9 10; USB1 A8 B8

## Via types
v1: diameter 1.8, hole 1.2, Top Layer to Bottom Layer, 1 via
v2: diameter 1, hole 0.6, Top Layer to Bottom Layer, 30 vias
v3: diameter 0.7, hole 0.3, Top Layer to Bottom Layer, 7 vias
v4: diameter 1.499, hole 0.914, Top Layer to Bottom Layer, 2 vias

## Routing (per net, layer and track width the routed paths; a pad name or vN(x,y) marks a point on that pad's centre or on a via; arc(x,y) is an arc through that point)
3V3: length 320.8
  Top Layer w0.2: P1.8 3.3,33.66 3.3,44.83 1.27,46.86 1.27,56.77 6.48,61.98 D3.1 6.48,67.84 U2.8
  Top Layer w0.254: R1.2 70.99,52.34 70.99,59.56 69.22,61.34 69.22,74.93 66.93,77.22 39.24,77.22 U5.15 36.32,80.14 19.18,80.14 ; R1.2 69.2,50.82 68.07,51.94 63.04,51.94 Q1.1 62.03,50.93 55.75,50.93 50.41,56.27 C8.2 C7.2 ; R1.2 81.53,50.55 83.06,49.02 83.06,10.41 74.55,1.91 60.94,1.91 59.59,0.55 46.69,0.55 42.67,4.57 42.67,7.87 43.32,8.52 ; U3.4 18.03,67.75 18.03,78.99 19.18,80.14 ; 19.18,80.14 10.54,80.14 5.46,75.06 5.46,69.57 U2.8 ; 37.98,8.95 40.72,8.95 40.78,8.89 ; C7.2 40.33,57.23 TEST3.1 ; C7.2 35.23,56.27 U3.2 ; 43.32,8.52 C5.2 ; 43.32,8.52 C4.2
5V: length 227.7
  Top Layer w0.2: 6.53,42.79 5.83,42.79 4.95,41.91 4.95,38.86 5.83,37.99 6.53,37.99
  Top Layer w0.254: 6.53,42.79 7.48,42.79 8.64,43.94 8.64,47.37 14.1,52.83 ; 14.1,52.83 17.02,49.91 17.02,47.75 17.65,47.12 D6.5 ; 14.1,52.83 14.1,59.61 10.54,63.17 10.54,68.78 U2.7 10.29,69.4 10.29,70.99 11.05,71.75 16.51,71.75 17.27,70.99 17.27,63.63 29.2,51.7 30.68,51.7 ; TEST2.1 79.25,39.5 v2(79.25,36.96) 74.68,36.96 C12.1 72.77,38.86 68.15,38.86 ; D2.2 69.6,25.3 69.6,29.46 R9.1 69.09,30.61 70.36,31.88 70.36,36.65 68.15,38.86 ; 68.15,38.86 68.15,40.69 62.61,46.23 62.61,49.28 62.36,49.53 37.35,49.53 C6.1 30.68,51.7 ; 30.68,51.7 32.26,53.28 32.26,57.78 33.16,58.69 U3.3 35.12,60.63 R6.2
  Bottom Layer w0.254: U5.2 81.79,67.69 81.79,39.5 v2(79.25,36.96)
GND:
  vias: v2(2.56,62.74) v2(9.02,11.18) v2(10.67,46.61) v2(12.7,34.54) v2(12.95,76.71) v2(21.46,52.2) v2(32.89,49.66) v2(37.59,52.7) v2(41.4,2.29) v2(44.07,60.83) v2(46.23,4.95) v2(50.67,41.4) v2(54.1,24.89) v2(61.2,65.17) v2(73.91,14.1) v2(79.63,55.5) v2(81.66,5.72) v3(64.03,35.94) v3(64.26,31.5) v3(66.29,35.94) v3(66.67,39.07) v3(67.69,31.88) v3(67.79,34.03) v3(69.34,55.37)
(no net):
  vias: v1(74.04,18.67)
BOOT: length 5
  Top Layer w0.254: 20.18,24.19 17.92,26.46 KEY2.4
BUZ: length 36
  Top Layer w0.254: v4(40.51,16.64) 38.05,16.64 37.98,16.57
  Bottom Layer w0.254: BUZZER1.1 65.84,18.67 48.26,18.67 45.85,16.26 40.89,16.26 v4(40.51,16.64)
CMD: length 40.1
  Top Layer w0.254: R3.2 v2(56.12,48.13) ; 32.26,25.59 v2(32.26,27.94)
  Bottom Layer w0.254: v2(56.12,48.13) 52.45,48.13 v2(32.26,27.94)
D+: length 42.8
  Top Layer w0.254: 43.59,24.87 44.2,25.48 44.2,26.8 42.57,28.42 42.21,28.42 42.06,28.27 41.7,28.27 40.99,28.99 40.99,29.35 41.13,29.5 41.13,29.86 40.42,30.58 40.06,30.58 39.91,30.43 39.55,30.43 38.83,31.15 38.83,31.51 38.98,31.65 38.98,32.01 28.7,42.29 28.7,45.97 28.02,46.66 24.72,46.66 24.03,45.97 R4.1 ; 43.59,24.87 42.93,24.21 41.16,24.21 41.15,24.19 37.98,24.19 ; 43.59,24.87 43.4,24.87 C2.2
D-: length 42.6
  Top Layer w0.254: 43.14,22.86 43.14,23.75 43.09,23.8 ; 37.98,22.92 40.41,22.92 41.29,23.8 43.09,23.8 ; 43.09,23.8 44.6,25.31 44.6,26.97 43.06,28.5 43.06,29.07 42.27,29.87 41.7,29.87 40.91,30.66 40.91,31.23 40.11,32.02 39.55,32.02 29.11,42.46 29.11,46.14 28.18,47.07 24.72,47.07 24.03,47.75 R5.1
DN: length 17.9
  Top Layer w0.2: 6.53,41.14 7.52,41.14 8.02,40.63 ; 8.02,40.63 7.52,40.14 6.53,40.14 ; 8.02,40.63 12.07,40.63 12.53,41.1 12.53,41.97 12.33,42.17 12.14,42.17 11.94,42.37 11.94,43.5 12.14,43.7 12.33,43.7 12.53,43.9 12.53,45.98 12.81,46.25 13.42,46.25 15.23,48.07 D6.1
DP: length 18.2
  Top Layer w0.127: 6.53,40.64 5.46,40.64 5.33,40.51 5.33,39.75 5.45,39.64 6.53,39.64
  Top Layer w0.2: 6.53,39.64 7.52,39.64 8.17,40.28 12.22,40.28 12.88,40.95 12.88,45.83 12.95,45.9 15.6,45.9 D6.3
IO8: length 43.8
  Top Layer w0.254: v4(40.51,21.59) 38.05,21.59 37.98,21.65
  Bottom Layer w0.254: 68.19,2.96 67.97,3.17 51.18,3.17 38.99,15.37 38.99,20.07 v4(40.51,21.59)
IO16: length 11.6
  Top Layer w0.254: 37.98,17.84 42.36,17.84 44.7,15.49 48.38,15.49 SPARE2.1
IO17: length 7.5
  Top Layer w0.254: SPARE1.1 44.07,19.11 37.98,19.11
LCD_D4: length 62.3
  Top Layer w0.254: 25.91,25.59 v2(25.91,27.94)
  Bottom Layer w0.254: U5.11 47.85,49.89 v2(25.91,27.94)
LCD_D5: length 61.8
  Top Layer w0.254: 24.64,25.59 v2(24.64,27.94)
  Bottom Layer w0.254: v2(24.64,27.94) 45.34,48.64 45.34,78.74 U5.12
LCD_D6: length 66.5
  Top Layer w0.254: 23.37,25.59 v2(23.37,27.94)
  Bottom Layer w0.254: v2(23.37,27.94) 23.37,36.45 27.69,40.77 27.69,72.77 28.19,73.28 37.29,73.28 U5.13
LCD_D7: length 78.2
  Top Layer w0.2: U1.33 21.18,16.63 21.46,16.91 21.46,24.38 21.33,24.51 21.34,27.18 v2(22.1,27.94)
  Bottom Layer w0.254: U5.14 36.02,74.55 23.75,74.55 22.61,73.41 22.61,29.84 22.1,29.34 v2(22.1,27.94)
LCD_EN: length 69.4
  Top Layer w0.254: 27.18,25.59 v2(27.18,27.94)
  Bottom Layer w0.254: v2(27.18,27.94) 53.98,54.74 53.98,75.06 54.61,75.69 58.67,75.69 60.55,77.57 U5.6
LCD_RS: length 71
  Top Layer w0.254: 28.45,25.59 v2(28.45,27.94)
  Bottom Layer w0.254: U5.4 64.92,78.77 59.82,73.66 59.82,55.88 58.04,54.1 54.61,54.1 v2(28.45,27.94)
MCU_RESET: length 37.4
  Top Layer w0.254: TEST4.1 58.36,9.19 49.65,9.19 ; C1.2 58.82,5.18 58.82,1.89 57.88,2.83 KEY3.4 49.65,9.19 ; 49.65,9.19 48.62,10.22 37.98,10.22
NEO: length 36.2
  Top Layer w0.254: LED1.4 68.88,12.62 68.2,11.94 57.28,11.94 48.77,20.45 38.05,20.45 37.98,20.38
OUT_COMMON: length 38.3
  Top Layer w0.254: K1.5 48.27,65.28 26.8,65.28 26.8,67.52 U2.4
OUT_NC: length 35.5
  Top Layer w0.254: K1.3 46.06,75.69 26.58,75.69 U2.5
OUT_NO: length 36.7
  Top Layer w0.254: K1.2 60.24,68.2 50.17,68.2 46.23,72.14 33.03,72.14 U2.3
POW+: length 65.5
  Top Layer w0.254: 57.91,37.34 59.31,38.74 v2(59.31,45.85) ; 57.91,37.34 57.79,37.21 C10.1 58.43,37.21 R7.1 ; 57.91,37.34 57.91,37.73 TEST1.1 ; R7.1 C11.2 ; R7.1 63.11,33.78 U4.5 ; v2(59.31,52.58) 59.31,58.17 50.55,66.93 37.39,66.93 U2.2
  Bottom Layer w0.254: v2(59.31,45.85) v2(59.31,52.58)
RFID_MISO: length 18.3
  Top Layer w0.254: 20.18,21.65 20.12,21.72 7.37,21.72 6.35,22.73 2.67,22.73 2.41,22.99
RFID_MOSI: length 18
  Top Layer w0.254: P1.3 3.18,20.07 3.56,20.45 20.08,20.45 20.21,20.32
RFID_RST: length 22.5
  Top Layer w0.254: 2.41,30.73 4.45,28.7 4.45,26.16 7.62,22.98 20.12,22.98 20.18,22.92
RFID_SCK: length 18.6
  Top Layer w0.254: 2.41,17.91 2.79,17.53 5.8,17.53 7.39,19.11 20.18,19.11
RFID_SDA: length 19.2
  Top Layer w0.254: 20.18,17.84 20.12,17.91 7.97,17.91 5.05,14.99 2.79,14.99 2.41,15.37
SPARE3: length 78.5
  Top Layer w0.254: 29.72,25.59 v2(29.72,27.94) ; U2.6 15.88,68.45 D5.1 15.88,62.74 30.61,48.01 v2(50.29,48.01)
  Bottom Layer w0.254: v2(29.72,27.94) 30.23,27.94 v2(50.29,48.01)
USB-D+: length 4.3
  Top Layer w0.254: R4.2 21.29,46.66 19.32,46.66 18.83,46.17 D6.4
USB-D-: length 4.5
  Top Layer w0.254: R5.2 21.6,47.24 19.26,47.24 18.44,48.07 D6.6
$1N85: length 9.1
  Top Layer w0.254: Q1.3 62.99,58.56 K1.1 66.25,58.65 D1.1
$1N86: length 14.5
  Top Layer w0.254: TEST5.1 68.58,46.6 67.2,47.99 R1.1 66.8,50.94 Q1.2 63.61,50.61 R3.1
$1N90: length 4.7
  Top Layer w0.254: D2.1 66.28,18.71 LED1.2
$1N92: length 3.2
  Top Layer w0.254: F3.2 15.88,55.8 D5.2
$1N93: length 4.6
  Top Layer w0.254: F1.2 6.68,59 6.73,59.04
$1N95: length 2.9
  Top Layer w0.254: 9.48,57.28 10.54,58.34 10.54,59.77
$1N15594: length 7.1
  Top Layer w0.254: U4.3 65.97,34.73 65.66,34.42 65.66,31.89 R9.2 66.94,28.85 R11.1
$1N15737: length 2.2
  Top Layer w0.254: U4.1 68.08,32.83 68.58,33.34
$1N15956: length 1.8
  Top Layer w0.254: U4.4 62.55,34.73 R7.2
$1N24952: length 3.8
  Top Layer w0.127: R12.2 10.25,38.64 6.53,38.64
$1N25390: length 3.9
  Top Layer w0.127: R10.1 9.92,41.92 9.64,41.64 6.53,41.64
$1N26975: length 14.2
  Top Layer w0.2: R8.2 R8.3 71.37,75.56 U5.3
$1N28552: length 11.8
  Top Layer w0.254: L1.1 65.15,38.53 65.15,38.26 ; 65.15,38.26 65.15,33.27 64.71,32.83 U4.6 ; 65.15,38.26 65.29,38.41 C9.2

## Copper pours and planes (outline as drawn; the poured copper is in the pictures)
GND on Top Layer: 0.13,81.22 83.82,81.22 83.82,0.14 0.13,0.14
GND on Bottom Layer: -0.25,81.53 83.57,81.53 83.57,-0.51 -0.25,-0.51

## Text on the board
Bottom Silkscreen Layer: 3V3  5V  EXT  NC COM  NO   +   - | S/N
Top Silkscreen Layer: GND 3V3 D7  D6  D5  D4 | 160mA | BOOT | 6.5-40VDC | RESET | NeoPixel | 3V Buzzer | max 250Vac 15A | 3V3  5V  EXT  NC  COM NO  IN+  GND | PROTECTION | LDO 3V3 | Command | Brightness | Buck 5V | HW REV 1.1 / May 2024
